# EasyEDA schematic HDMI_switch.json
TITLE: HDMI switch; REV: 1.0; Date: 2021-12-05; Sheet: 1/1; Company: András Lanczki
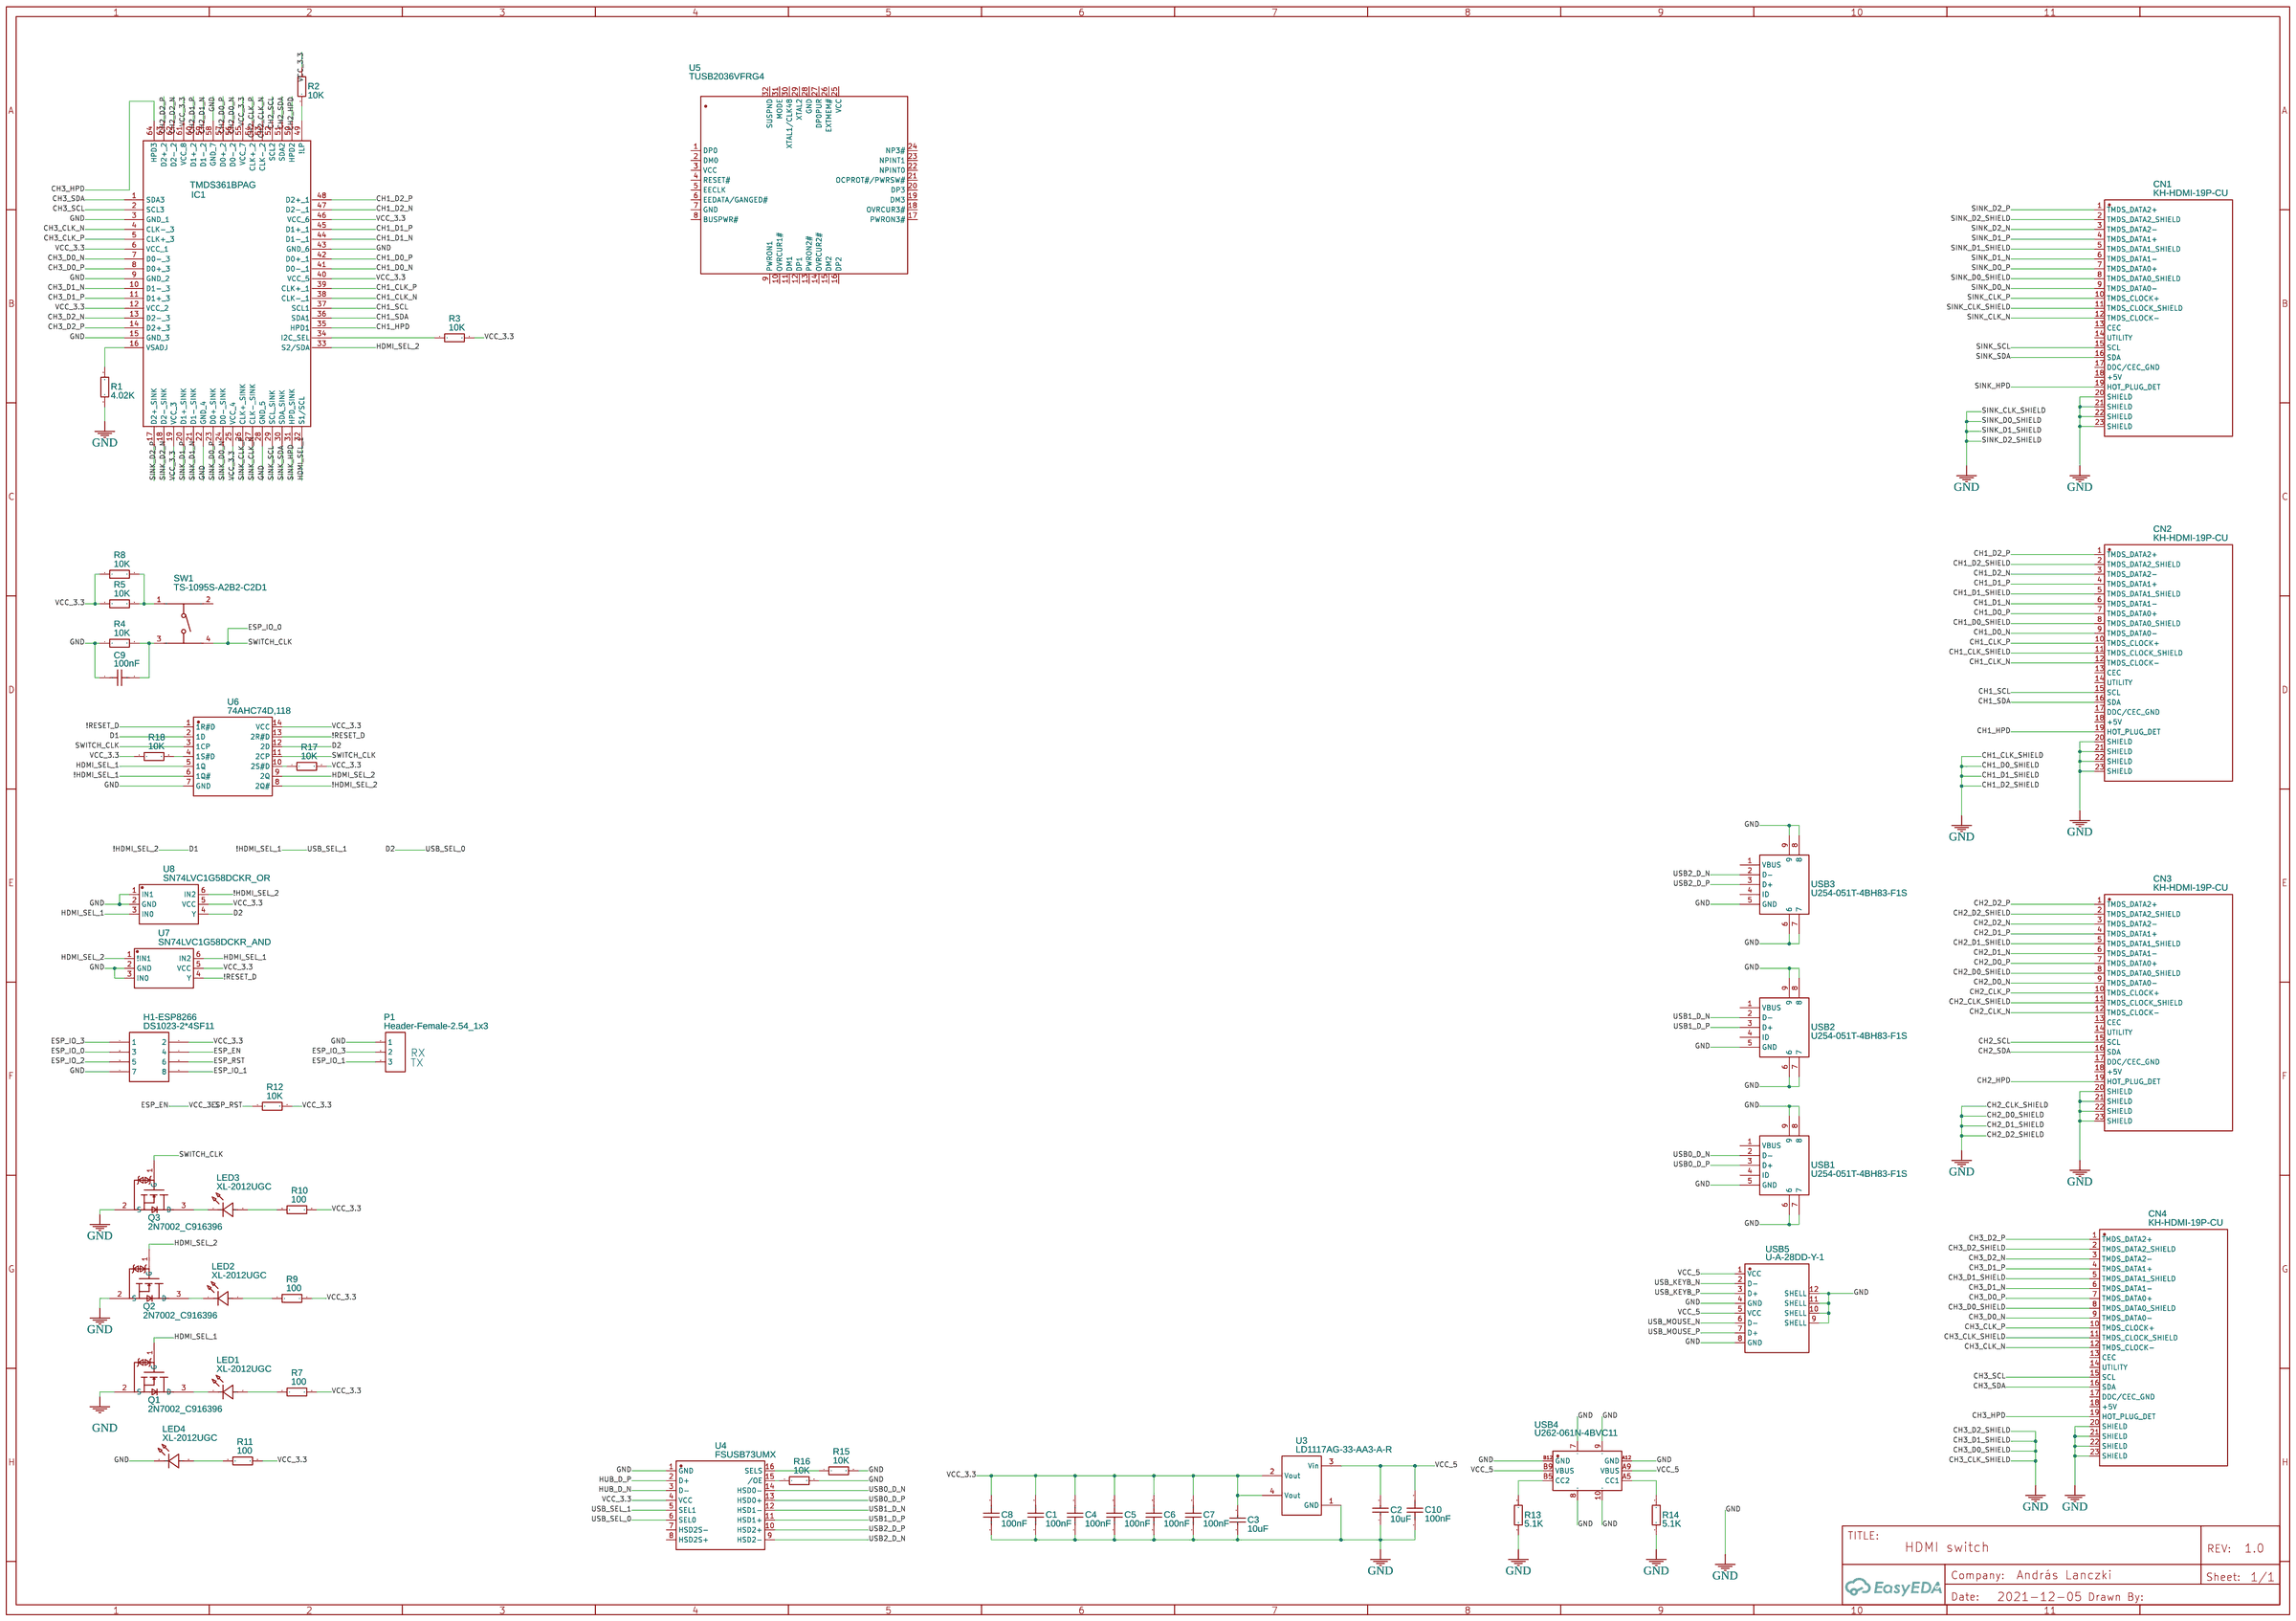
[diagram p0: schematic sheet]

## Parts
C1  100nF  [C0402]
C2  10uF  [C1206]
C3  10uF  [C1206]
C4  100nF  [C0402]
C5  100nF  [C0402]
C6  100nF  [C0402]
C7  100nF  [C0402]
C8  100nF  [C0402]
C9  100nF  [C0402]
C10  100nF  [C0402]
CN1  KH-HDMI-19P-CU  [HDMI-SMD_KH-HDMI-19P-CU]
CN2  KH-HDMI-19P-CU  [HDMI-SMD_KH-HDMI-19P-CU]
CN3  KH-HDMI-19P-CU  [HDMI-SMD_KH-HDMI-19P-CU]
CN4  KH-HDMI-19P-CU  [HDMI-SMD_KH-HDMI-19P-CU]
H1-ESP8266  DS1023-2*4SF11  [HDR-TH_8P-P2.54-V-F-R2-C4-S2.54-1]
IC1  TMDS361BPAG  [QFP50P1200X1200X120-64N]
LED1  XL-2012UGC  [LED0805-RD_GREEN]
LED2  XL-2012UGC  [LED0805-RD_GREEN]
LED3  XL-2012UGC  [LED0805-RD_GREEN]
LED4  XL-2012UGC  [LED0805-RD_GREEN]
P1  Header-Female-2.54_1x3  [HDR-TH_3P-P2.54-V-F]
Q1  2N7002_C916396  [SOT-23-3_L2.9-W1.3-P1.90-LS2.4-BR]
Q2  2N7002_C916396  [SOT-23-3_L2.9-W1.3-P1.90-LS2.4-BR]
Q3  2N7002_C916396  [SOT-23-3_L2.9-W1.3-P1.90-LS2.4-BR]
R1  4.02K  [R0805]
R2  10K  [R0603]
R3  10K  [R0603]
R4  10K  [R0603]
R5  10K  [R0603]
R7  100  [R0603]
R8  10K  [R0603]
R9  100  [R0603]
R10  100  [R0603]
R11  100  [R0603]
R12  10K  [R0603]
R13  5.1K  [R0402]
R14  5.1K  [R0402]
R15  10K  [R0603]
R16  10K  [R0603]
R17  10K  [R0603]
R18  10K  [R0603]
SW1  TS-1095S-A2B2-C2D1  [KEY-SMD_4P-L6.0-W6.0-P4.50-LS8.6]
U3  LD1117AG-33-AA3-A-R  [SOT-223-4_L6.5-W3.5-P2.30-LS7.0-BR]
U4  FSUSB73UMX  [UMLP-16_L2.6-W1.8-P0.40-BL]
U5  TUSB2036VFRG4  [LQFP-32_L7.0-W7.0-P0.80-LS9.0-BL]
U6  74AHC74D,118  [SOP-14_L8.6-W3.9-P1.27-LS6.0-BL]
U7  SN74LVC1G58DCKR_AND  [SOT-363_L2.0-W1.3-P0.65-LS2.1-BR]
U8  SN74LVC1G58DCKR_OR  [SOT-363_L2.0-W1.3-P0.65-LS2.1-BR]
USB1  U254-051T-4BH83-F1S  [MICRO-USB-SMD_U254-051T-4BH83-F1S]
USB2  U254-051T-4BH83-F1S  [MICRO-USB-SMD_U254-051T-4BH83-F1S]
USB3  U254-051T-4BH83-F1S  [MICRO-USB-SMD_U254-051T-4BH83-F1S]
USB4  U262-061N-4BVC11  [USB-SMD_U262-061N-4BVC11]
USB5  U-A-28DD-Y-1  [USB-A-TH_U-A-28DD-Y-1]

## Library data of the parts
C1 C4-C10 = CC0402KRX7R7BB104: Supplier: LCSC; Manufacturer: YAGEO; Supplier Part: C60474; JLCPCB Part Class: Extended Part
C2 C3 = CL31A106KAHNNNE: Supplier: LCSC; Manufacturer: SAMSUNG; Supplier Part: C9807; JLCPCB Part Class: Extended Part
CN1-CN4 = KH-HDMI-19P-CU: Supplier: LCSC; Supplier Part: C709361; Manufacturer: kinghelm(金航标); Manufacturer Part: KH-HDMI-19P-Cu; Contributor: LCSC; JLCPCB Part Class: Extended Part
H1-ESP8266 = DS1023-2*4SF11: Supplier: LCSC; Manufacturer: CONNFLY; Contributor: LCSC; Supplier Part: C92271; JLCPCB Part Class: Extended Part
IC1 = TMDS361BPAG: Contributor: daxdax52
LED1-LED4 = XL-2012UGC: Supplier: LCSC; Supplier Part: C965815; Manufacturer: XINGLIGHT(成兴光); JLCPCB Part Class: Extended Part; Contributor: LCSC
P1 = Header-Female-2.54_1x3: Supplier Part: C146243; Supplier: LCSC; Manufacturer: Boom Precision Elec; link: https://datasheet.lcsc.com/szlcsc/Boom-Precision-Elec-2-54mm-1-8P-Straight-Female-header_C27438.pdf; JLCPCB Part Class: Extended Part
Q1-Q3 = 2N7002_C916396: Supplier: LCSC; Supplier Part: C916396; Manufacturer: JSMSEMI(杰盛微); Manufacturer Part: 2N7002; Contributor: LCSC; JLCPCB Part Class: Extended Part; Package Display: No
R1 = TC0525B4021T5E: Supplier: LCSC; Manufacturer: UniOhm; Supplier Part: C88431; JLCPCB Part Class: Extended Part
R2-R5 R8 R12 R15-R18 = RS-03K103JT: Supplier: LCSC; Manufacturer: FH; Supplier Part: C73809; JLCPCB Part Class: Extended Part
R7 R9-R11 = 0603WAJ0101T5E: Supplier: LCSC; Manufacturer: UniOhm; Supplier Part: C25201; JLCPCB Part Class: Extended Part
R13 R14 = RC0402FR-075K1L: Supplier: LCSC; Manufacturer: YAGEO; Supplier Part: C105872; JLCPCB Part Class: Extended Part
SW1 = TS-1095S-A2B2-C2D1: Supplier: LCSC; Supplier Part: C782826; Manufacturer: Yuandi; Contributor: LCSC; JLCPCB Part Class: Extended Part
U3 = LD1117AG-33-AA3-A-R: Supplier: LCSC; Manufacturer: UTC; Supplier Part: C71121; JLCPCB Part Class: Extended Part
U4 = FSUSB73UMX: Supplier: LCSC; Supplier Part: C895431; Manufacturer: onsemi(安森美); Contributor: LCSC
U5 = TUSB2036VFRG4: Supplier: LCSC; Supplier Part: C2678093; Manufacturer: TI(德州仪器); Contributor: LCSC; JLCPCB Part Class: Extended Part
U6 = 74AHC74D,118: Supplier: LCSC; Supplier Part: C282412; Manufacturer: Nexperia; Contributor: LCSC; JLCPCB Part Class: Extended Part
U7 U8 = SN74LVC1G58DCKR: Supplier: LCSC; Manufacturer: TI; Supplier Part: C7842; JLCPCB Part Class: Extended Part
USB1-USB3 = U254-051T-4BH83-F1S: Supplier: LCSC; Supplier Part: C397452; Manufacturer: XKB Enterprise; Contributor: LCSC; JLCPCB Part Class: Extended Part
USB4 = U262-061N-4BVC11: Supplier: LCSC; Supplier Part: C2764612; Manufacturer: XKB Connectivity(中国星坤); Contributor: LCSC
USB5 = U-A-28DD-Y-1: Supplier: LCSC; Supplier Part: C530601; Manufacturer: 韩国韩荣; Contributor: LCSC

## Nets
VCC_5: C2.2 C10.2 U3.3(Vin) USB4.A9(VBUS) USB4.B9(VBUS) USB5.1(VCC) USB5.5(VCC)
!HDMI_SEL_1: U4.5(SEL1) U6.6(1Q#)
!HDMI_SEL_2: U6.2(1D) U6.8(2Q#) U8.6(IN2)
!RESET_D: U6.1(1R#D) U6.13(2R#D) U7.4(Y)
CH1_CLK_N: CN2.12(TMDS_CLOCK-) IC1.38(CLK-_1)
CH1_CLK_P: CN2.10(TMDS_CLOCK+) IC1.39(CLK+_1)
CH1_CLK_SHIELD: C1.1 C2.1 C3.1 C4.1 C5.1 C6.1 C7.1 C8.1 C9.1 C10.1 CN1.2(TMDS_DATA2_SHIELD) CN1.5(TMDS_DATA1_SHIELD) CN1.8(TMDS_DATA0_SHIELD) CN1.11(TMDS_CLOCK_SHIELD) CN1.20(SHIELD) CN1.21(SHIELD) CN1.22(SHIELD) CN1.23(SHIELD) CN2.2(TMDS_DATA2_SHIELD) CN2.5(TMDS_DATA1_SHIELD) CN2.8(TMDS_DATA0_SHIELD) CN2.11(TMDS_CLOCK_SHIELD) CN2.20(SHIELD) CN2.21(SHIELD) CN2.22(SHIELD) CN2.23(SHIELD) CN3.2(TMDS_DATA2_SHIELD) CN3.5(TMDS_DATA1_SHIELD) CN3.8(TMDS_DATA0_SHIELD) CN3.11(TMDS_CLOCK_SHIELD) CN3.20(SHIELD) CN3.21(SHIELD) CN3.22(SHIELD) CN3.23(SHIELD) CN4.2(TMDS_DATA2_SHIELD) CN4.5(TMDS_DATA1_SHIELD) CN4.8(TMDS_DATA0_SHIELD) CN4.11(TMDS_CLOCK_SHIELD) CN4.20(SHIELD) CN4.21(SHIELD) CN4.22(SHIELD) CN4.23(SHIELD) H1-ESP8266.7 IC1.3(GND_1) IC1.9(GND_2) IC1.15(GND_3) IC1.22(GND_4) IC1.28(GND_5) IC1.43(GND_6) IC1.58(GND_7) LED4.1(K) P1.1 Q1.2(S) Q2.2(S) Q3.2(S) R1.1 R4.1 R13.1 R14.1 R15.2 R16.2 U3.1(GND) U4.1(GND) U6.7(GND) U7.2(GND) U7.3(IN0) U8.1(IN1) U8.2(GND) USB1.5(GND) USB1.6 USB1.7 USB1.8 USB1.9 USB2.5(GND) USB2.6 USB2.7 USB2.8 USB2.9 USB3.5(GND) USB3.6 USB3.7 USB3.8 USB3.9 USB4.7 USB4.8 USB4.9 USB4.10 USB4.A12(GND) USB4.B12(GND) USB5.4(GND) USB5.8(GND) USB5.9(SHELL) USB5.10(SHELL) USB5.11(SHELL) USB5.12(SHELL)
CH1_D0_N: CN2.9(TMDS_DATA0-) IC1.41(D0-_1)
CH1_D0_P: CN2.7(TMDS_DATA0+) IC1.42(D0+_1)
CH1_D1_N: CN2.6(TMDS_DATA1-) IC1.44(D1-_1)
CH1_D1_P: CN2.4(TMDS_DATA1+) IC1.45(D1+_1)
CH1_D2_N: CN2.3(TMDS_DATA2-) IC1.47(D2-_1)
CH1_D2_P: CN2.1(TMDS_DATA2+) IC1.48(D2+_1)
CH1_HPD: CN2.19(HOT_PLUG_DET) IC1.35(HPD1)
CH1_SCL: CN2.15(SCL) IC1.37(SCL1)
CH1_SDA: CN2.16(SDA) IC1.36(SDA1)
CH2_CLK_N: CN3.12(TMDS_CLOCK-) IC1.53(CLK-_2)
CH2_CLK_P: CN3.10(TMDS_CLOCK+) IC1.54(CLK+_2)
CH2_D0_N: CN3.9(TMDS_DATA0-) IC1.56(D0-_2)
CH2_D0_P: CN3.7(TMDS_DATA0+) IC1.57(D0+_2)
CH2_D1_N: CN3.6(TMDS_DATA1-) IC1.59(D1-_2)
CH2_D1_P: CN3.4(TMDS_DATA1+) IC1.60(D1+_2)
CH2_D2_N: CN3.3(TMDS_DATA2-) IC1.62(D2-_2)
CH2_D2_P: CN3.1(TMDS_DATA2+) IC1.63(D2+_2)
CH2_HPD: CN3.19(HOT_PLUG_DET) IC1.50(HPD2)
CH2_SCL: CN3.15(SCL) IC1.52(SCL2)
CH2_SDA: CN3.16(SDA) IC1.51(SDA2)
CH3_CLK_N: CN4.12(TMDS_CLOCK-) IC1.4(CLK-_3)
CH3_CLK_P: CN4.10(TMDS_CLOCK+) IC1.5(CLK+_3)
CH3_D0_N: CN4.9(TMDS_DATA0-) IC1.7(D0-_3)
CH3_D0_P: CN4.7(TMDS_DATA0+) IC1.8(D0+_3)
CH3_D1_N: CN4.6(TMDS_DATA1-) IC1.10(D1-_3)
CH3_D1_P: CN4.4(TMDS_DATA1+) IC1.11(D1+_3)
CH3_D2_N: CN4.3(TMDS_DATA2-) IC1.13(D2-_3)
CH3_D2_P: CN4.1(TMDS_DATA2+) IC1.14(D2+_3)
CH3_HPD: CN4.19(HOT_PLUG_DET) IC1.64(HPD3)
CH3_SCL: CN4.15(SCL) IC1.2(SCL3)
CH3_SDA: CN4.16(SDA) IC1.1(SDA3)
D2: U4.6(SEL0) U6.12(2D) U8.4(Y)
ESP_EN: C1.2 C3.2 C4.2 C5.2 C6.2 C7.2 C8.2 H1-ESP8266.2 H1-ESP8266.4 IC1.6(VCC_1) IC1.12(VCC_2) IC1.19(VCC_3) IC1.25(VCC_4) IC1.40(VCC_5) IC1.46(VCC_6) IC1.55(VCC_7) IC1.61(VCC_8) R2.2 R3.2 R5.1 R7.2 R8.1 R9.2 R10.2 R11.2 R12.2 R17.2 R18.1 U3.2(Vout) U3.4(Vout) U4.4(VCC) U6.14(VCC) U7.5(VCC) U8.5(VCC)
ESP_IO_0: H1-ESP8266.3 Q3.1(G) SW1.4 U6.3(1CP) U6.11(2CP)
ESP_IO_1: H1-ESP8266.8 P1.3
ESP_IO_2: H1-ESP8266.5
ESP_IO_3: H1-ESP8266.1 P1.2
ESP_RST: H1-ESP8266.6 R12.1
HDMI_SEL_1: IC1.32(S1/SCL) Q1.1(G) U6.5(1Q) U7.6(IN2) U8.3(IN0)
HDMI_SEL_2: IC1.33(S2/SDA) Q2.1(G) U6.9(2Q) U7.1(!IN1)
HUB_D_N: U4.3(D-)
HUB_D_P: U4.2(D+)
SINK_CLK_N: CN1.12(TMDS_CLOCK-) IC1.27(CLK-_SINK)
SINK_CLK_P: CN1.10(TMDS_CLOCK+) IC1.26(CLK+_SINK)
SINK_D0_N: CN1.9(TMDS_DATA0-) IC1.24(D0-_SINK)
SINK_D0_P: CN1.7(TMDS_DATA0+) IC1.23(D0+_SINK)
SINK_D1_N: CN1.6(TMDS_DATA1-) IC1.21(D1-_SINK)
SINK_D1_P: CN1.4(TMDS_DATA1+) IC1.20(D1+_SINK)
SINK_D2_N: CN1.3(TMDS_DATA2-) IC1.18(D2-_SINK)
SINK_D2_P: CN1.1(TMDS_DATA2+) IC1.17(D2+_SINK)
SINK_HPD: CN1.19(HOT_PLUG_DET) IC1.31(HPD_SINK)
SINK_SCL: CN1.15(SCL) IC1.29(SCL_SINK)
SINK_SDA: CN1.16(SDA) IC1.30(SDA_SINK)
USB0_D_N: U4.14(HSD0-) USB1.2(D-)
USB0_D_P: U4.13(HSD0+) USB1.3(D+)
USB1_D_N: U4.12(HSD1-) USB2.2(D-)
USB1_D_P: U4.11(HSD1+) USB2.3(D+)
USB2_D_N: U4.9(HSD2-) USB3.2(D-)
USB2_D_P: U4.10(HSD2+) USB3.3(D+)
USB_KEYB_N: USB5.2(D-)
USB_KEYB_P: USB5.3(D+)
USB_MOUSE_N: USB5.6(D-)
USB_MOUSE_P: USB5.7(D+)
Net-(C9-2): C9.2 R4.2 SW1.3
Net-(IC1-16): IC1.16(VSADJ) R1.2
Net-(IC1-34): IC1.34(I2C_SEL) R3.1
Net-(IC1-49): IC1.49(!LP) R2.1
Net-(LED1-1): LED1.1(K) Q1.3(D)
Net-(LED1-2): LED1.2(A) R7.1
Net-(LED2-1): LED2.1(K) Q2.3(D)
Net-(LED2-2): LED2.2(A) R9.1
Net-(LED3-1): LED3.1(K) Q3.3(D)
Net-(LED3-2): LED3.2(A) R10.1
Net-(LED4-2): LED4.2(A) R11.1
Net-(R5-2): R5.2 R8.2 SW1.1
Net-(R13-2): R13.2 USB4.B5(CC2)
Net-(R14-2): R14.2 USB4.A5(CC1)
Net-(R15-1): R15.1 U4.16(SELS)
Net-(R16-1): R16.1 U4.15(/OE)
Net-(R17-1): R17.1 U6.10(2S#D)
Net-(R18-2): R18.2 U6.4(1S#D)

Not connected (* = marked no-connect by the designer): CN1 13(CEC) 14(UTILITY) 17(DDC/CEC_GND) 18(+5V); CN2 13(CEC) 14(UTILITY) 17(DDC/CEC_GND) 18(+5V); CN3 13(CEC) 14(UTILITY) 17(DDC/CEC_GND) 18(+5V); CN4 13(CEC) 14(UTILITY) 17(DDC/CEC_GND) 18(+5V); SW1 2; U4 7(HSD2S-) 8(HSD2S+); U5 1(DP0) 2(DM0) 3(VCC) 4(RESET#) 5(EECLK) 6(EEDATA/GANGED#) 7(GND) 8(BUSPWR#) 9(PWRON1) 10(OVRCUR1#) 11(DM1) 12(DP1) 13(PWRON2#) 14(OVRCUR2#) 15(DM2) 16(DP2) 17(PWRON3#) 18(OVRCUR3#) 19(DM3) 20(DP3) 21(OCPROT#/PWRSW#) 22(NPINT0) 23(NPINT1) 24(NP3#) 25(VCC) 26(EXTMEM#) 27(DP0PUR) 28(GND) 29(XTAL2) 30(XTAL1/CLK48) 31(MODE) 32(SUSPND); USB1 1(VBUS) 4(ID); USB2 1(VBUS) 4(ID); USB3 1(VBUS) 4(ID)

## Notes on the sheet
- RX
- TX
